# EAGLE schematic ADC_BOARD_V1 (EAGLE 7.5.0)
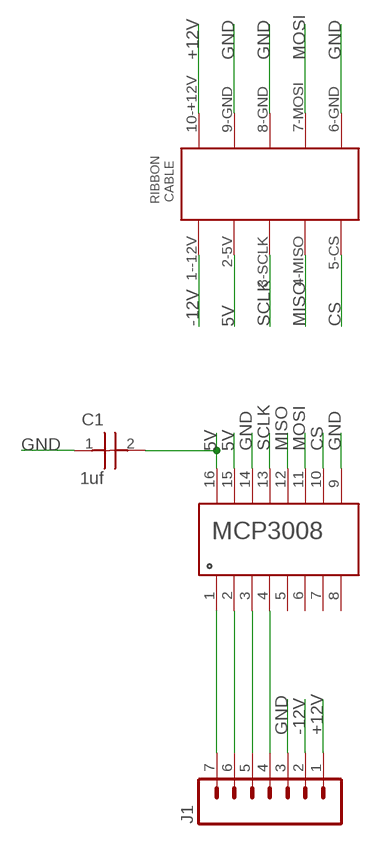
[diagram p0: schematic, sheet 1]

## Parts
C1  1uf  CAP1206  [CAP1206]
J1  M07  [1X07]
U$1  5X2RIBBONCONNECTOR  [5X2RIBBONCONNECTOR]
U$2  MCP3008-SOIC16  [SOIC16N]

## Nets
5V: C1.2 U$1.2-5V U$2.15(15-VREF) U$2.16(16-VDD)
+12V: J1.1 U$1.10-+12V
-12V: J1.2 U$1.1--12V
CS: U$1.5-CS U$2.10(10-CS)
GND: C1.1 J1.3 U$1.6-GND U$1.8-GND U$1.9-GND U$2.9(9-DGND) U$2.14(14-AGND)
MISO: U$1.4-MISO U$2.12(12-DOUT)
MOSI: U$1.7-MOSI U$2.11(11-DIN)
N$1: J1.7 U$2.1(1-CH0)
N$2: J1.6 U$2.2(2-CH1)
N$3: J1.5 U$2.3(3-CH2)
N$4: J1.4 U$2.4(4-CH3)
SCLK: U$1.3-SCLK U$2.13(13-CLK)
Unconnected: U$2.5(5-CH4) U$2.6(6-CH5) U$2.7(7-CH6) U$2.8(8-CH7)

## Library data of the parts
C1 = RSC-16:CAP1206: CAPACITOR, 1206; MPN: C1206C103K5RACTU; OC_FARNELL: 1414713; OC_NEWARK: 61H7741; SUPPLIER: Kemet; TOLERANCE: ±10%; VALUE: 10nF; VOLTAGERATING: 50V
J1 = SparkFun-Connectors:M07: Header 7 Standard 7-pin 0.1" header. Use with straight break away headers (SKU : PRT-00116), right angle break away headers (PRT-00553), swiss pins (PRT-00743), machine pins (PRT-00117), and female headers (PRT-00115). NOTES ON THE VARIANTS LOCK and LOCK_LONGPADS... This footprint was designed to help hold the alignment of a through-hole component (i.e. 7-pin header) while soldering it into place. You may notice that each hole has been shifted either up or down by 0.005 of an inch from it's more standard position (which is usually a perfectly straight line). This slight alteration caused the pins (the squares in the middle) to touch the edges of the holes. Because they are alternating, it causes a "brace" to hold the header in place. 0.005 has proven to be the perfect amount of "off-center" position when using our standard breakaway headers. Although looks a little odd when you look at the bare footprint, once you have a header in there, the alteration is very hard to notice. Also, if you push a header all the way into place, it is covered up entirely on the bottom side. This idea of altering the position of holes to aid alignment will be further integrated into the Sparkfun Library for other footprints. It can help hold any component with 3 or more connection pins.
U$1 = RSC-16:5X2RIBBONCONNECTOR
U$2 = RSC-16:MCP3008-SOIC16